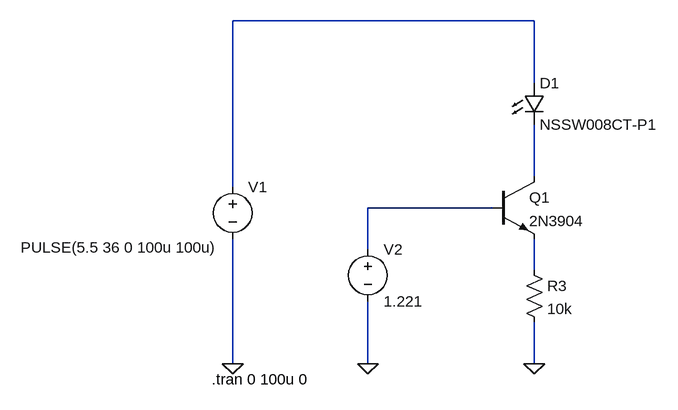
[diagram p0: schematic led_drive.asc]
led_drive.asc, the LTspice schematic file:
Version 4
SHEET 1 1080 680
WIRE 288 -192 -176 -192
WIRE 288 -96 288 -192
WIRE 288 48 288 -32
WIRE -176 64 -176 -192
WIRE 224 96 32 96
WIRE 32 160 32 96
WIRE 288 192 288 144
WIRE -176 336 -176 144
WIRE 32 336 32 240
WIRE 288 336 288 272
FLAG 288 336 0
FLAG -176 336 0
FLAG 32 336 0
SYMBOL voltage -176 48 R0
WINDOW 123 0 0 Left 0
WINDOW 39 0 0 Left 0
WINDOW 3 -326 109 Left 2
SYMATTR Value PULSE(5.5 36 0 100u 100u)
SYMATTR InstName V1
SYMBOL npn 224 48 R0
SYMATTR InstName Q1
SYMATTR Value 2N3904
SYMBOL res 272 176 R0
SYMATTR InstName R3
SYMATTR Value 10k
SYMBOL voltage 32 144 R0
WINDOW 123 0 0 Left 0
WINDOW 39 0 0 Left 0
SYMATTR InstName V2
SYMATTR Value 1.221
SYMBOL LED 272 -96 R0
SYMATTR InstName D1
SYMATTR Value NSSW008CT-P1
TEXT -208 360 Left 2 !.tran 0 100u 0

The netlist it stands for:
* led_drive.asc
V1 N001 0 PULSE(5.5 36 0 100u 100u)
Q1 N002 N003 N004 0 2N3904
R3 N004 0 10k
V2 N003 0 1.221
D1 N001 N002 NSSW008CT-P1
.model D D
.lib standard.dio
.model NPN NPN
.model PNP PNP
.lib standard.bjt
.tran 0 100u 0
.backanno
.end